# EAGLE design ME433_First_PCB (EAGLE 9.6.2)
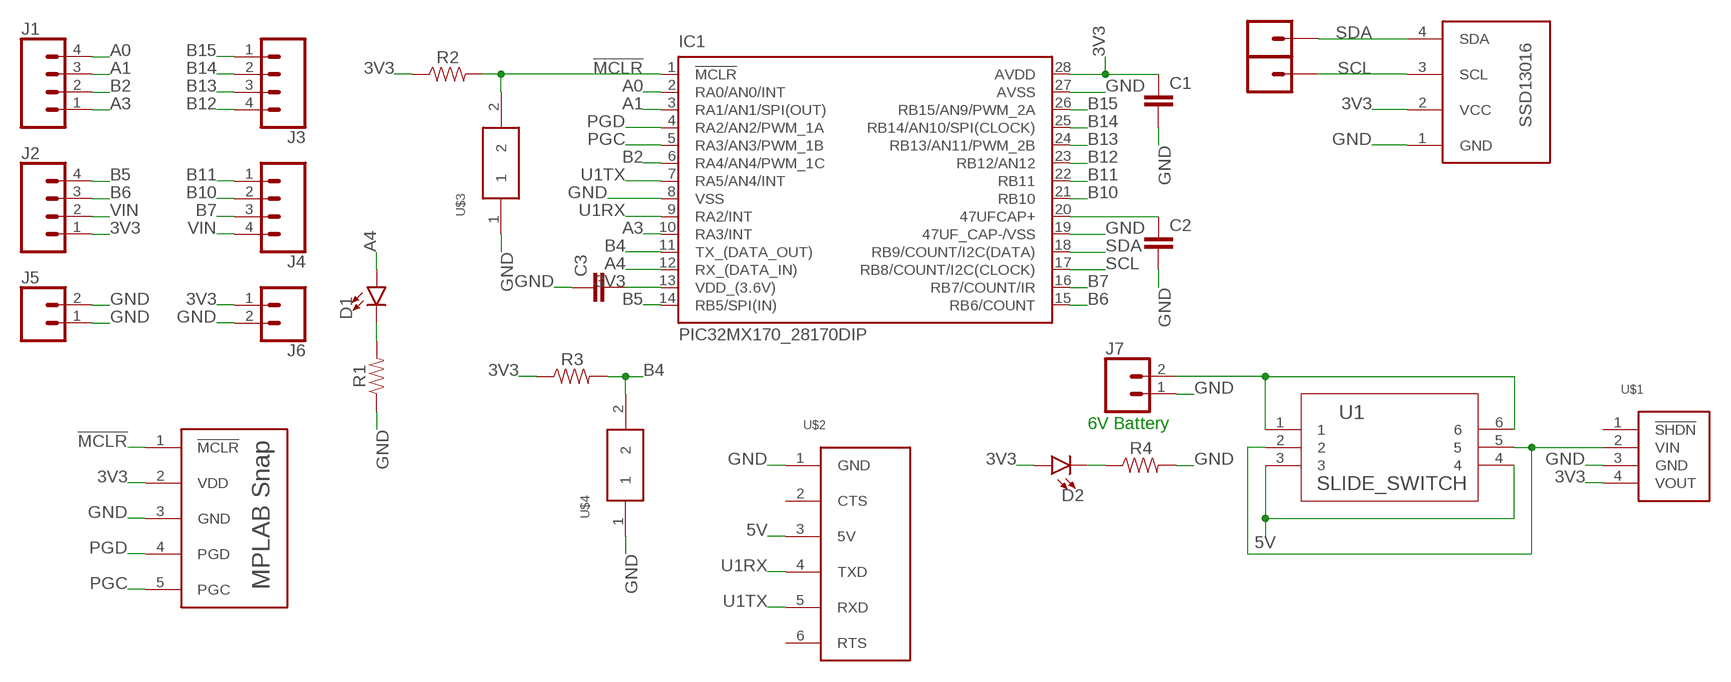
[diagram p0: schematic, sheet 1]

## Parts
C1  C-EU025-025X050  [C025-025X050]
C2  C-EU025-025X050  [C025-025X050]
C3  C-EU025-025X050  [C025-025X050]
D1  LED3MM  [LED_3MM]
D2  LED3MM  [LED_3MM]
IC1  PIC32MX170_28170DIP  [DIL28-3]
J1  CONN_04  [1X04]
J2  CONN_04  [1X04]
J3  CONN_04  [1X04]
J4  CONN_04  [1X04]
J5  CONN_02  [1X02]
J6  CONN_02  [1X02]
J7  CONN_02  [1X02]
J8  CONN_01  [1X01]
J9  CONN_01  [1X01]
OLED  OLED_SCREEN  [OLED_SCREEN]
R1  1M  1MOHM-HORIZ-1/4W-5%  [AXIAL-0.3]
R2  1M  1MOHM-HORIZ-1/4W-5%  [AXIAL-0.3]
R3  1M  1MOHM-HORIZ-1/4W-5%  [AXIAL-0.3]
R4  1M  1MOHM-HORIZ-1/4W-5%  [AXIAL-0.3]
U1  SLIDE_SWITCH  [SWITCH_011CQN]
U$1  POLOLU_3V3_VREG  [POLOLU_3V3_VREG]
U$2  ADAFRUIT_CP2104  [ADAFRUIT_CP2104]
U$3  BUTTON  [BUTTON]
U$4  BUTTON  [BUTTON]
U$5  MPLAB_SNAP  [MPLAB_SNAP]

## Nets
3V3: C1.1 C3.2 D2.A IC1.13(VDD_(3.6V)) IC1.28(AVDD) J2.1 J6.1 OLED.2(VCC) R2.P$1 R3.P$1 U$1.4(VOUT) U$5.2(VDD)
5V: U1.3 U1.4 U$2.3(5V)
!MCLR: IC1.1(!MCLR!) R2.P$2 U$3.2 U$5.1(!MCLR)
A0: IC1.2(RA0/AN0/INT) J1.4
A1: IC1.3(RA1/AN1/SPI(OUT)) J1.3
A3: IC1.10(RA3/INT) J1.1
A4: D1.A IC1.12(RX_(DATA_IN))
B2: IC1.6(RA4/AN4/PWM_1C) J1.2
B4: IC1.11(TX_(DATA_OUT)) R3.P$2 U$4.2
B5: IC1.14(RB5/SPI(IN)) J2.4
B6: IC1.15(RB6/COUNT) J2.3
B7: IC1.16(RB7/COUNT/IR) J4.3
B10: IC1.21(RB10) J4.2
B11: IC1.22(RB11) J4.1
B12: IC1.23(RB12/AN12) J3.4
B13: IC1.24(RB13/AN11/PWM_2B) J3.3
B14: IC1.25(RB14/AN10/SPI(CLOCK)) J3.2
B15: IC1.26(RB15/AN9/PWM_2A) J3.1
GND: C1.2 C2.2 C3.1 IC1.8(VSS) IC1.19(47UF_CAP-/VSS) IC1.27(AVSS) J5.1 J5.2 J6.2 J7.1 OLED.1(GND) R1.P$1 R4.P$2 U$1.3(GND) U$2.1(GND) U$3.1 U$4.1 U$5.3(GND)
N$2: C2.1 IC1.20(47UFCAP+)
N$9: D1.K(C) R1.P$2
N$10: D2.K(C) R4.P$1
N$12: J7.2 U1.1 U1.6
PGC: IC1.5(RA3/AN3/PWM_1B) U$5.5(PGC)
PGD: IC1.4(RA2/AN2/PWM_1A) U$5.4(PGD)
SCL: IC1.17(RB8/COUNT/I2C(CLOCK)) J9.1 OLED.3(SCL)
SDA: IC1.18(RB9/COUNT/I2C(DATA)) J8.1 OLED.4(SDA)
U1RX: IC1.9(RA2/INT) U$2.4(TXD)
U1TX: IC1.7(RA5/AN4/INT) U$2.5(RXD)
VIN: J2.2 J4.4 U1.2 U1.5 U$1.2(VIN)
Unconnected: U$1.1(!SHDN) U$2.2(CTS) U$2.6(RTS)

## Notes on the sheet
- 6V Battery

## Library data of the parts
C1-C3 = ME433_First_PCB:C-EU: CAPACITOR, European symbol; SPICEPREFIX: C
D1 D2 = ME433_First_PCB:LED: LED (Generic) Standard schematic elements and footprints for 5mm, 3mm, 1206, and 0603 sized LEDs. Generic LEDs with no color specified.; PROD_ID: DIO-08794
IC1 = ME433_First_PCB:PIC32MX170_28: PIC32MX170F256B
J1-J4 = SparkFun-Connectors:CONN_04: Multi connection point. Often used as Generic Header-pin footprint for 0.1 inch spaced/style header connections On any of the 0.1 inch spaced packages, you can populate with these: Break Away Headers - Straight <https://www.sparkfun.com/products/116> (PRT-00116) Break Away Male Headers - Right Angle <https://www.sparkfun.com/products/553> (PRT-00553) Female Headers <https://www.sparkfun.com/products/115> (PRT-00115) Break Away Headers - Machine Pin <https://www.sparkfun.com/products/117> (PRT-00117) Break Away Female Headers - Swiss Machine Pin <https://www.sparkfun.com/products/743> (PRT-00743) For SCREWTERMINALS and SPRING TERMINALS visit here: Screw Terimnals on SparkFun.com <https://www.sparkfun.com/search/results?term=Screw+Terminals> (5mm/3.5mm/2.54mm spacing) This device is also useful as a general connection point to wire up your design to another part of your project. Our various solder wires solder well into these plated through hole pads. Hook-Up Wire - Assortment (Stranded, 22 AWG) <https://www.sparkfun.com/products/11375> (PRT-11375) Hook-Up Wire - Assortment (Solid Core, 22 AWG) <https://www.sparkfun.com/products/11367> (PRT-11367) View the entire wire category on our website here <https://www.sparkfun.com/categories/141> Special notes: Molex polarized connector foot print use with SKU : PRT-08231 with associated crimp pins and housings. 1MM SMD Version SKU: PRT-10208; PROD_ID: CONN-09696
J5-J7 = SparkFun-Connectors:CONN_02: Multi connection point. Often used as Generic Header-pin footprint for 0.1 inch spaced/style header connections On any of the 0.1 inch spaced packages, you can populate with these: Break Away Headers - Straight <https://www.sparkfun.com/products/116> (PRT-00116) Break Away Male Headers - Right Angle <https://www.sparkfun.com/products/553> (PRT-00553) Female Headers <https://www.sparkfun.com/products/115> (PRT-00115) Break Away Headers - Machine Pin <https://www.sparkfun.com/products/117> (PRT-00117) Break Away Female Headers - Swiss Machine Pin <https://www.sparkfun.com/products/743> (PRT-00743) For SCREWTERMINALS and SPRING TERMINALS visit here: Screw Terimnals on SparkFun.com <https://www.sparkfun.com/search/results?term=Screw+Terminals> (5mm/3.5mm/2.54mm spacing) This device is also useful as a general connection point to wire up your design to another part of your project. Our various solder wires solder well into these plated through hole pads. Hook-Up Wire - Assortment (Stranded, 22 AWG) <https://www.sparkfun.com/products/11375> (PRT-11375) Hook-Up Wire - Assortment (Solid Core, 22 AWG) <https://www.sparkfun.com/products/11367> (PRT-11367) View the entire wire category on our website here <https://www.sparkfun.com/categories/141> Special notes: Molex polarized connector foot print use with: PRT-08233 with associated crimp pins and housings. 2.54_SCREWTERM for use with PRT-10571. 3.5mm Screw Terminal footprints for PRT-08084 5mm Screw Terminal footprints for use with PRT-08432
J8 J9 = SparkFun-Connectors:CONN_01: Single connection point. Often used as Generic Header-pin footprint for 0.1 inch spaced/style header connections On any of the 0.1 inch spaced packages, you can populate with these: Break Away Headers - Straight <https://www.sparkfun.com/products/116> (PRT-00116) Break Away Male Headers - Right Angle <https://www.sparkfun.com/products/553> (PRT-00553) Female Headers <https://www.sparkfun.com/products/115> (PRT-00115) Break Away Headers - Machine Pin <https://www.sparkfun.com/products/117> (PRT-00117) Break Away Female Headers - Swiss Machine Pin <https://www.sparkfun.com/products/743> (PRT-00743) This device is also useful as a general connection point to wire up your design to another part of your project. Our various solder wires solder well into these plated through hole pads. Hook-Up Wire - Assortment (Stranded, 22 AWG) <https://www.sparkfun.com/products/11375> (PRT-11375) Hook-Up Wire - Assortment (Solid Core, 22 AWG) <https://www.sparkfun.com/products/11367> (PRT-11367) View the entire wire category on our website here <https://www.sparkfun.com/categories/141> Special notes: SMTSO-256-ET is a "flush mount" nut for a 4-40 screw. We mostly use this on specialty testbeds; it is a nice way to connect hardware to your PCB at an adjustable hieght. Also note, the SNAP packages are for using a snappable style connector. We sell a baggie of snaps and they are also used on two LilyPad designs: Snap Assortment - 30 pack (male and female) <https://www.sparkfun.com/products/11347> (DEV-11347) LilyPad Arduino SimpleSnap <https://www.sparkfun.com/products/10941> (DEV-10941) LilyPad SimpleSnap Protoboard <https://www.sparkfun.com/products/10940> (DEV-10940)
OLED = ME433_First_PCB:OLED_SCREEN
R1-R4 = ME433_First_PCB:1MOHM: 1MΩ resistor A resistor is a passive two-terminal electrical component that implements electrical resistance as a circuit element. Resistors act to reduce current flow, and, at the same time, act to lower voltage levels within circuits. - Wikipedia; PROD_ID: RES-09329
U1 = ME433_First_PCB:SLIDE_SWITCH; COPYRIGHT: Copyright (C) 2022 Ultra Librarian. All rights reserved.; DIGI-KEY_PART_NUMBER_1: 401-2001-ND; MANUFACTURER_PART_NUMBER: JS202011CQN; MFR_NAME: C&K
U$1 = ME433_First_PCB:POLOLU_3V3_VREG
U$2 = ME433_First_PCB:ADAFRUIT_CP2104
U$3 U$4 = ME433_First_PCB:BUTTON
U$5 = ME433_First_PCB:MPLAB_SNAP

## Board
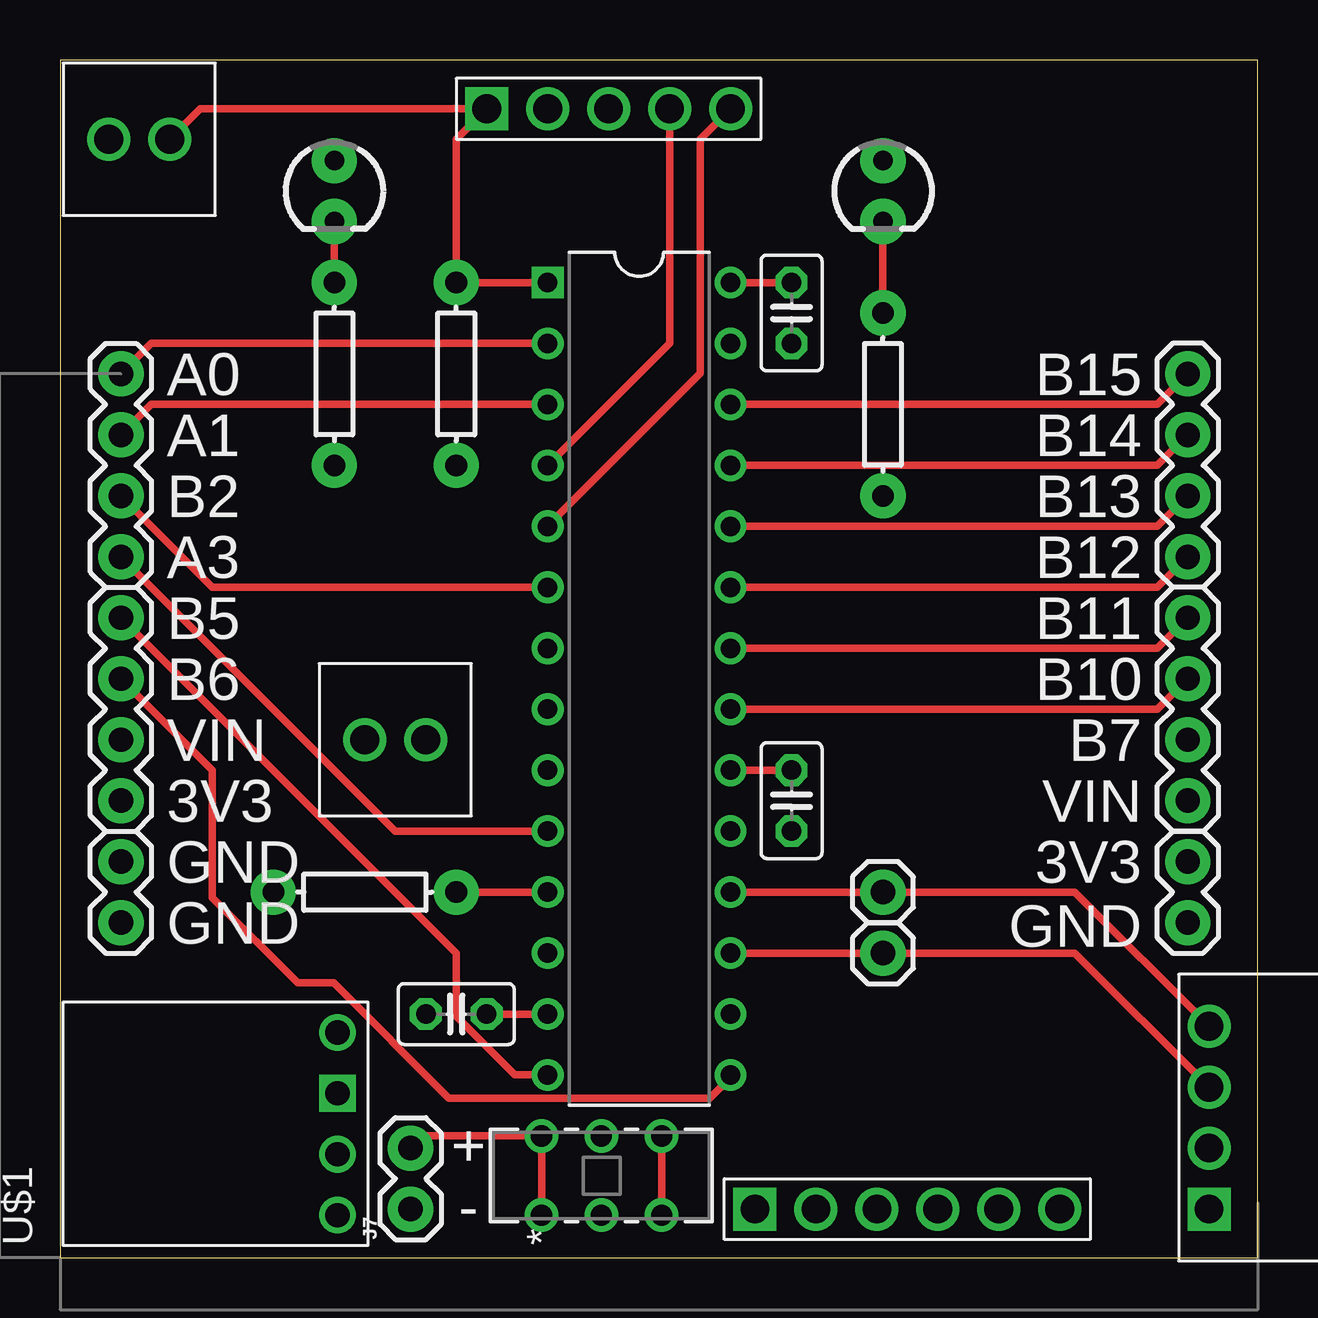
[diagram p1: board, top side]
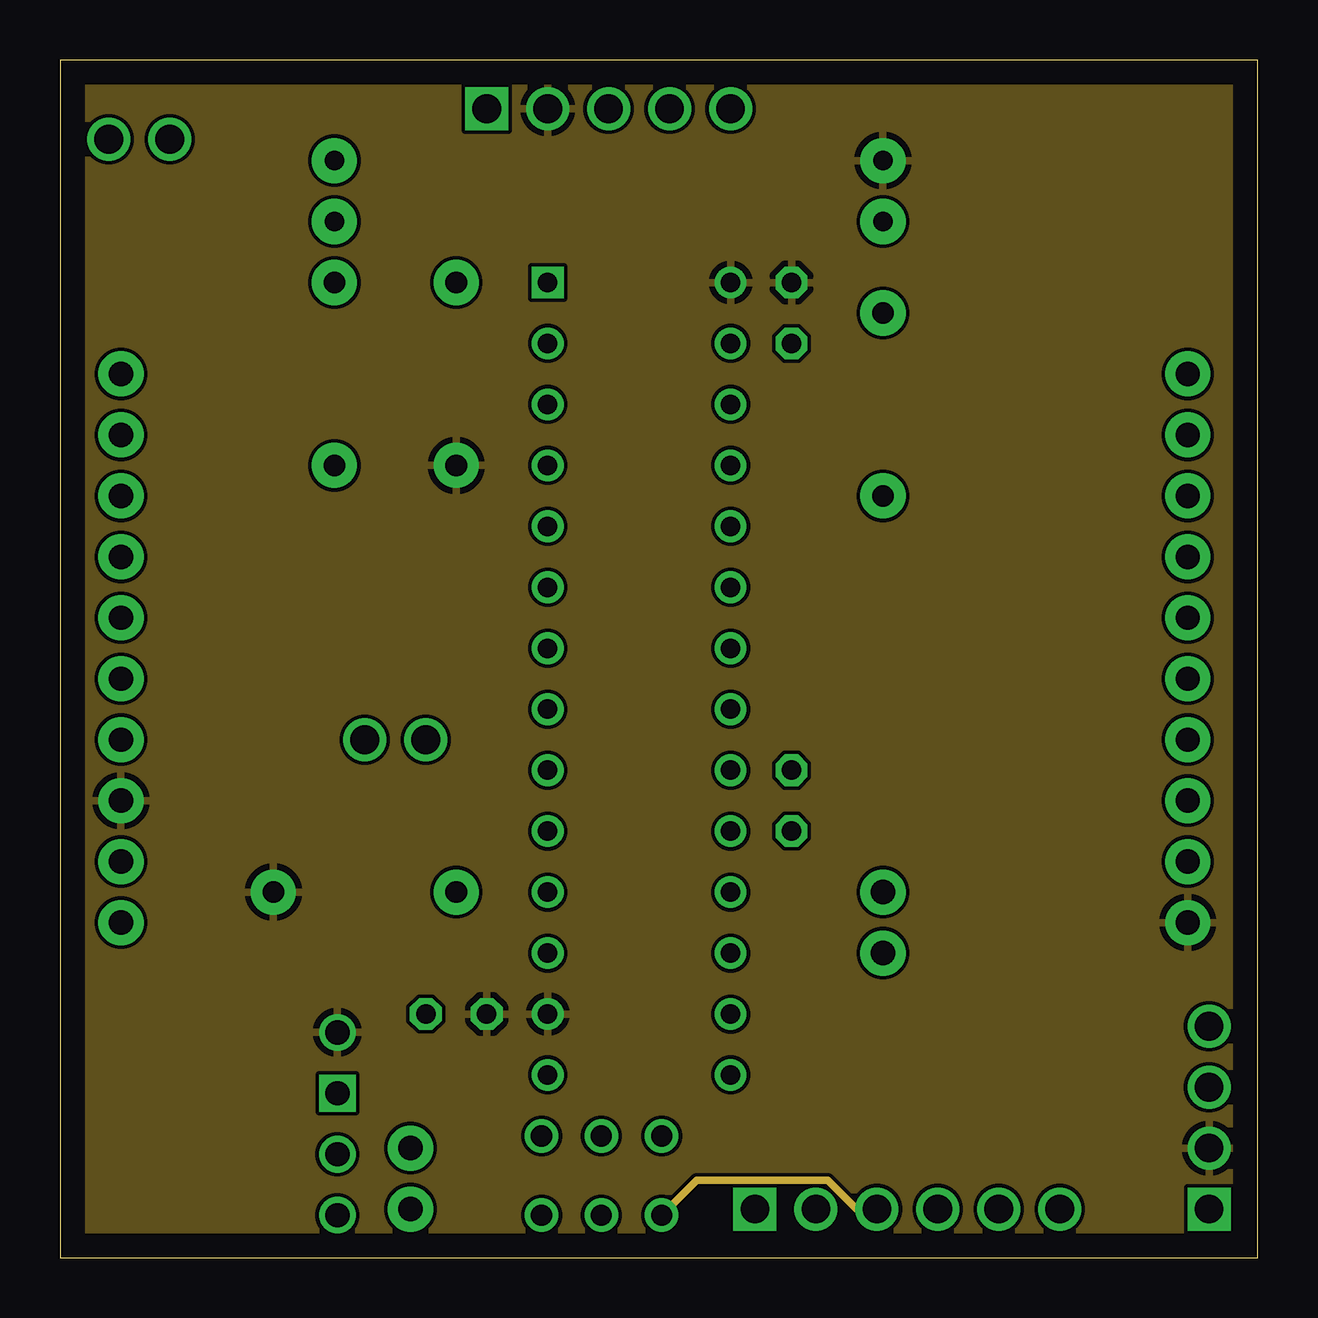
[diagram p2: board, inner layer Route2]
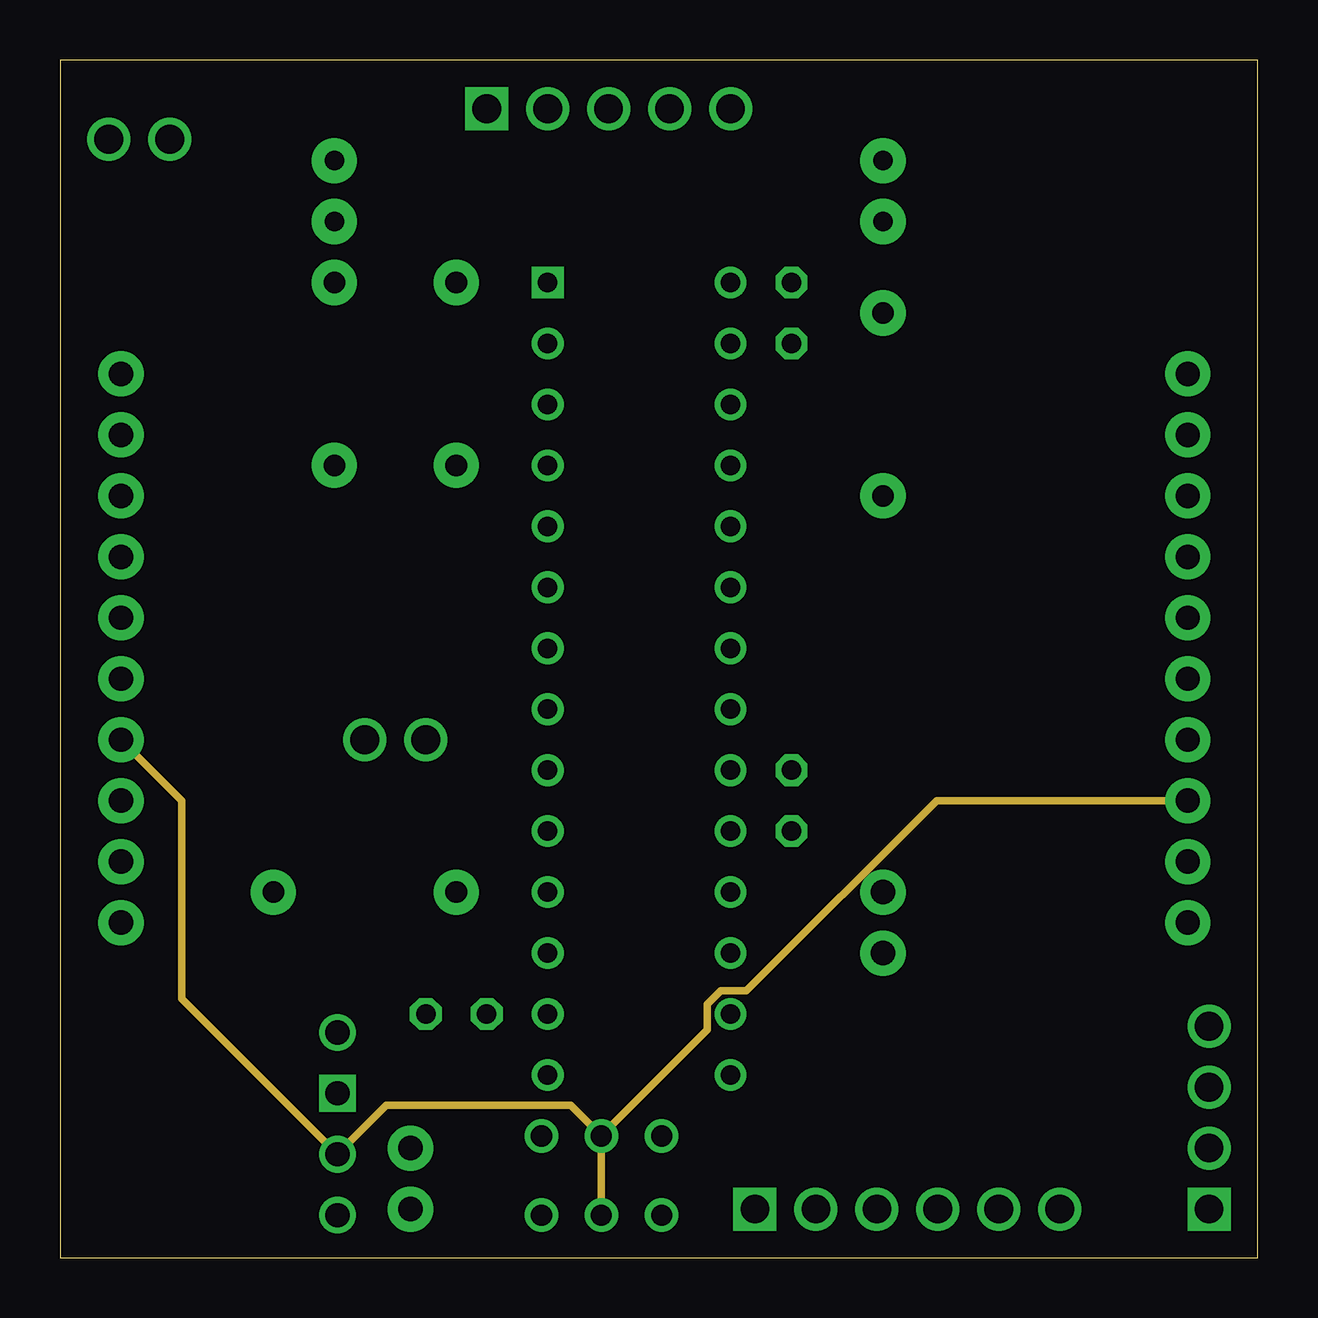
[diagram p3: board, inner layer Route15]
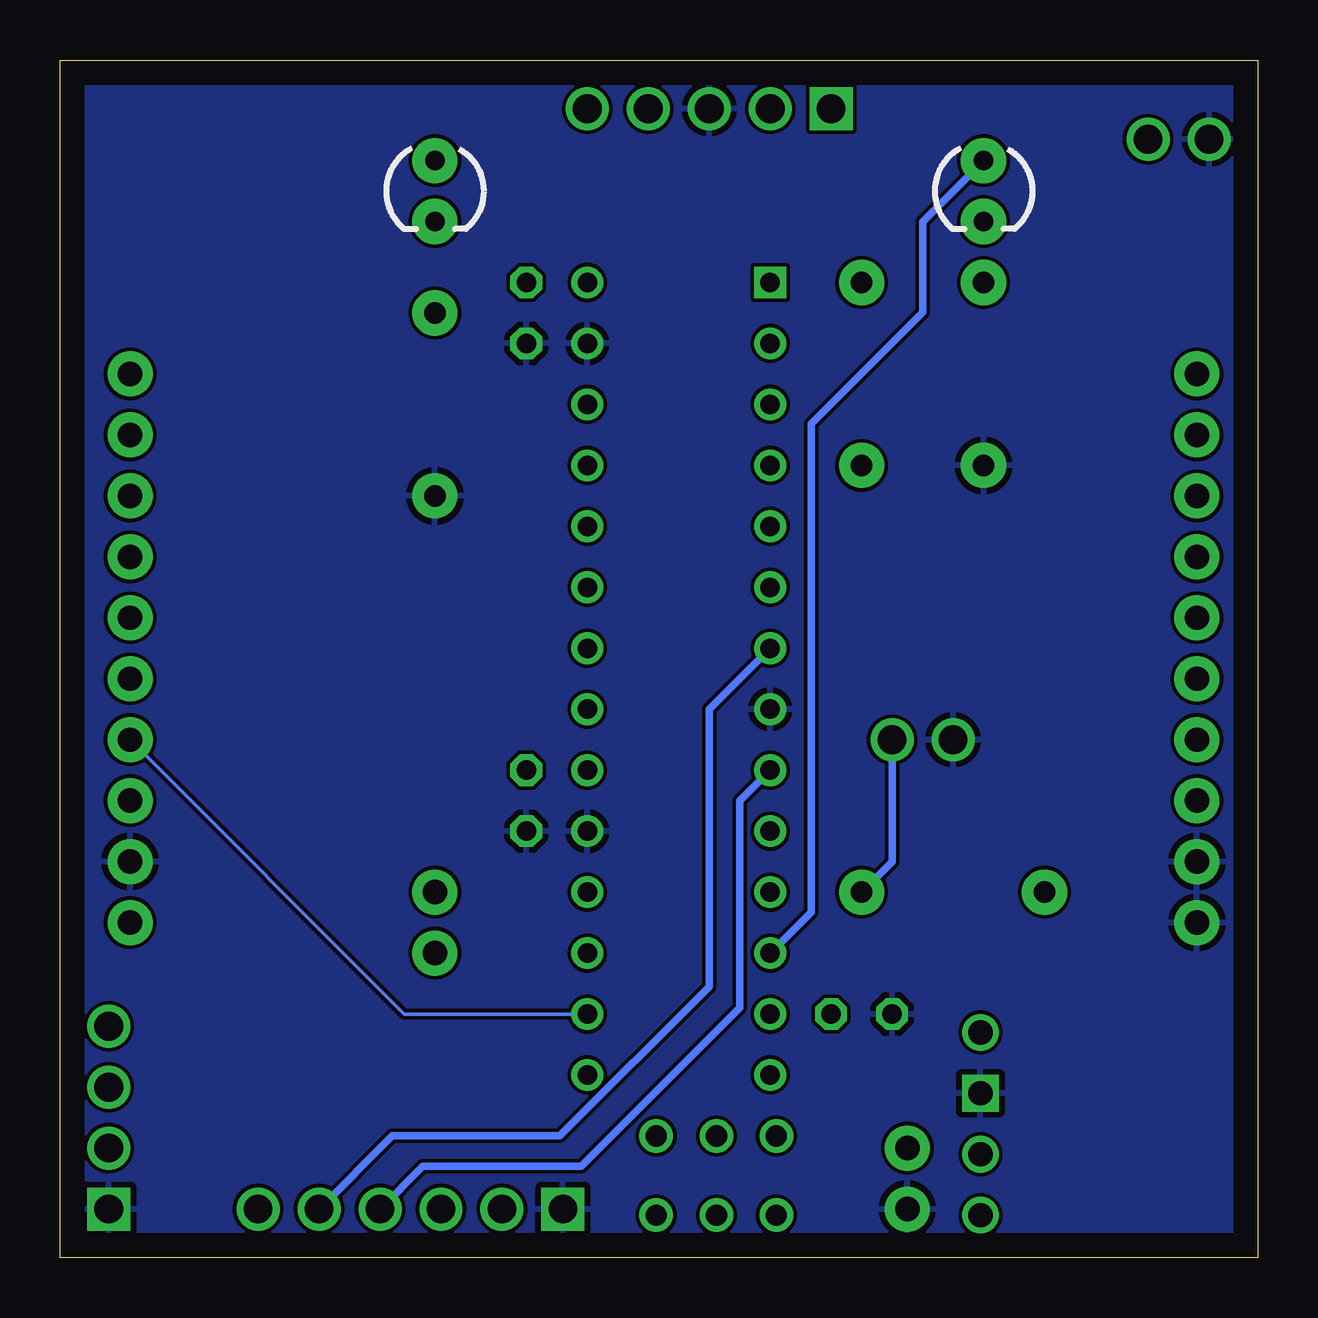
[diagram p4: board, bottom side, seen from below]

Size 49.91 x 49.91 mm. Coordinates in mm from the lower left corner, seen from the top.
Outline: 0,0 49.91,0 49.91,49.91 0,49.91 0,0
Copper layers (1+2*15+16): Top 0.035mm / dielectric 1.5mm / Route2 0.035mm / dielectric 0.15mm / Route15 0.035mm / dielectric 0.2mm / Bottom 0.035mm
Design rules "default *": minimum track width 6mil, minimum drill 0.35mm, track to track 6mil, track to pad 6mil, pad to pad 6mil, via to via 6mil, smd to smd 6mil, copper to edge 40mil, drill to drill 6mil, minimum pad ring 10mil, minimum via ring 8mil, stop-mask expansion 4mil, vias tented up to drill 0mil, thermal gap 10mil

### Footprints (pad centres in the part's own frame; a part is rotated, then mirrored left to right if it is on the bottom)
C025-025X050 = drill 0.813 octagon: 1 -1.27,0; 2 1.27,0
LED_3MM = drill 0.813 pad 1.88: A -1.27,0; K 1.27,0
DIL28-3 = drill 0.813 square: 1 -16.51,-3.81 | drill 0.813: 2 -13.97,-3.81; 3 -11.43,-3.81; 4 -8.89,-3.81; 5 -6.35,-3.81; 6 -3.81,-3.81; 7 -1.27,-3.81; 8 1.27,-3.81; 9 3.81,-3.81; 10 6.35,-3.81; 11 8.89,-3.81; 12 11.43,-3.81; 13 13.97,-3.81; 14 16.51,-3.81; 15 16.51,3.81; 16 13.97,3.81; 17 11.43,3.81; 18 8.89,3.81; 19 6.35,3.81; 20 3.81,3.81; 21 1.27,3.81; 22 -1.27,3.81; 23 -3.81,3.81; 24 -6.35,3.81; 25 -8.89,3.81; 26 -11.43,3.81; 27 -13.97,3.81; 28 -16.51,3.81
1X04 = drill 1.016 pad 1.88: 1 0,0; 2 2.54,0; 3 5.08,0; 4 7.62,0
1X02 = drill 1.016 pad 1.88: 1 0,0; 2 2.54,0
1X01 = drill 1.016 pad 1.88: 1 0,0
OLED_SCREEN = drill 1.194 square: 1 7.62,0 | drill 1.194: 2 5.08,0; 3 2.54,0; 4 0,0
AXIAL-0.3 = drill 0.9 pad 1.88: P$1 -3.81,0; P$2 3.81,0
SWITCH_011CQN = drill 0.889 pad 1.397: 1 0,0; 2 0,-2.489; 3 0,-5.004; 4 3.302,-5.004; 5 3.302,-2.489; 6 3.302,0
POLOLU_3V3_VREG = drill 1.016: 1 -3.81,-5.08; 2 -1.27,-5.08; 4 3.81,-5.08 | drill 1.016 square: 3 1.27,-5.08
ADAFRUIT_CP2104 = drill 1.194 square: 1 0,0 | drill 1.194: 2 2.54,0; 3 5.08,0; 4 7.62,0; 5 10.16,0; 6 12.7,0
BUTTON = drill 1.194: 1 0,0; 2 2.54,0
MPLAB_SNAP = drill 1.194 square: 1 0,0 | drill 1.194: 2 2.54,0; 3 5.08,0; 4 7.62,0; 5 10.16,0

### Placement (x,y rotation side)
C1  16.51,10.16 180 top
C2  30.48,19.05 270 top
C3  30.48,39.37 90 top
D1  11.43,44.45 270 top
D2  34.29,44.45 270 top
IC1  24.13,24.13 270 top
J1  2.54,29.21 90 top
J2  2.54,19.05 90 top
J3  46.99,36.83 270 top
J4  46.99,26.67 270 top
J5  2.54,13.97 90 top
J6  46.99,13.97 90 top
J7  14.61,2.03 90 top
J8  34.29,15.24 0 top
J9  34.29,12.7 0 top
OLED  47.88,9.65 270 top
R1  11.43,36.83 90 top
R2  16.51,36.83 90 top
R3  12.7,15.24 0 top
R4  34.29,35.56 270 top
U1  20.07,1.78 90 top
U$1  6.48,5.59 90 top
U$2  28.96,2.03 0 top
U$3  2.03,46.61 0 top
U$4  12.7,21.59 0 top
U$5  17.78,47.88 0 top

### Tracks (layer width: path | path; a pad name or v marks a point on that pad's centre or on a via)
3V3
  Top 0.305: C1.1 IC1.13 | IC1.28 C3.2
  pour Route2: 0,0 0,49.91 49.91,49.91 49.91,0
5V
  Top 0.305: U1.4 U1.3
  Route2 0.305: U$2.3 33.19,2.03 31.99,3.23 26.52,3.23 U1.3
!MCLR
  Top 0.305: IC1.1 R2.P$2 16.51,46.61 U$5.1 5.84,47.88 U$3.2
A0
  Top 0.305: J1.4 3.81,38.1 IC1.2
A1
  Top 0.305: IC1.3 3.81,35.56 J1.3
A3
  Top 0.305: J1.1 13.97,17.78 IC1.10
A4
  Bottom 0.305: D1.A 13.97,43.18 13.97,39.4 18.62,34.75 18.62,14.4 IC1.12
B2
  Top 0.305: J1.2 6.35,27.94 IC1.6
B4
  Top 0.305: R3.P$2 IC1.11
  Bottom 0.305: R3.P$2 15.24,16.51 U$4.2
B5
  Top 0.305: IC1.14 18.95,7.62 16.51,10.06 16.51,12.7 J2.4
B6
  Top 0.305: J2.3 6.35,20.32 6.35,15 9.9,11.46 11.4,11.46 16.2,6.66 27.07,6.66 27.94,7.53 IC1.15
B7
  Bottom 0.152: IC1.16 35.56,10.16 J4.3
B10
  Top 0.305: IC1.21 45.72,22.86 J4.2
B11
  Top 0.305: IC1.22 45.72,25.4 J4.1
B12
  Top 0.305: IC1.23 45.72,27.94 J3.4
B13
  Top 0.305: IC1.24 45.72,30.48 J3.3
B14
  Top 0.305: J3.2 45.72,33.02 IC1.25
B15
  Top 0.305: IC1.26 45.72,35.56 J3.1
GND
  pour Bottom: 0,49.91 49.91,49.91 49.91,0 0,0
N$2
  Top 0.305: C2.1 IC1.20
N$9
  Top 0.305: R1.P$2 D1.K
N$10
  Top 0.305: R4.P$1 D2.K
N$12
  Top 0.305: U1.1 U1.6 15.11,5.08 J7.2
PGC
  Top 0.305: U$5.5 26.67,46.61 26.67,36.86 20.32,30.51 IC1.5
PGD
  Top 0.305: U$5.4 25.4,38.1 IC1.4
SCL
  Top 0.152: 47.82,7.18 OLED.3
  Top 0.305: 47.82,7.18 42.29,12.7 IC1.17 J9.1
SDA
  Top 0.305: IC1.18 J8.1 42.29,15.24 OLED.4
U1RX
  Bottom 0.305: IC1.9 21.59,19.05 21.59,10.41 28.19,3.81 34.8,3.81 U$2.4
U1TX
  Bottom 0.305: U$2.5 36.07,5.08 29.08,5.08 22.86,11.3 22.86,22.86 IC1.7
VIN
  Route15 0.305: J2.2 5.08,19.05 5.08,10.79 U$1.2 13.59,6.35 21.29,6.35 U1.5 | U1.2 U1.5 | J4.4 36.52,19.05 28.6,11.12 27.54,11.12 26.98,10.56 26.98,9.5 U1.5

### Text on the board
tPlace: A0 | B15 | A1 | B14 | B2 | B13 | A3 | B12 | B5 | B11 | B6 | B10 | VIN | B7 | 3V3 | VIN | GND | 3V3 | GND | GND | + | -